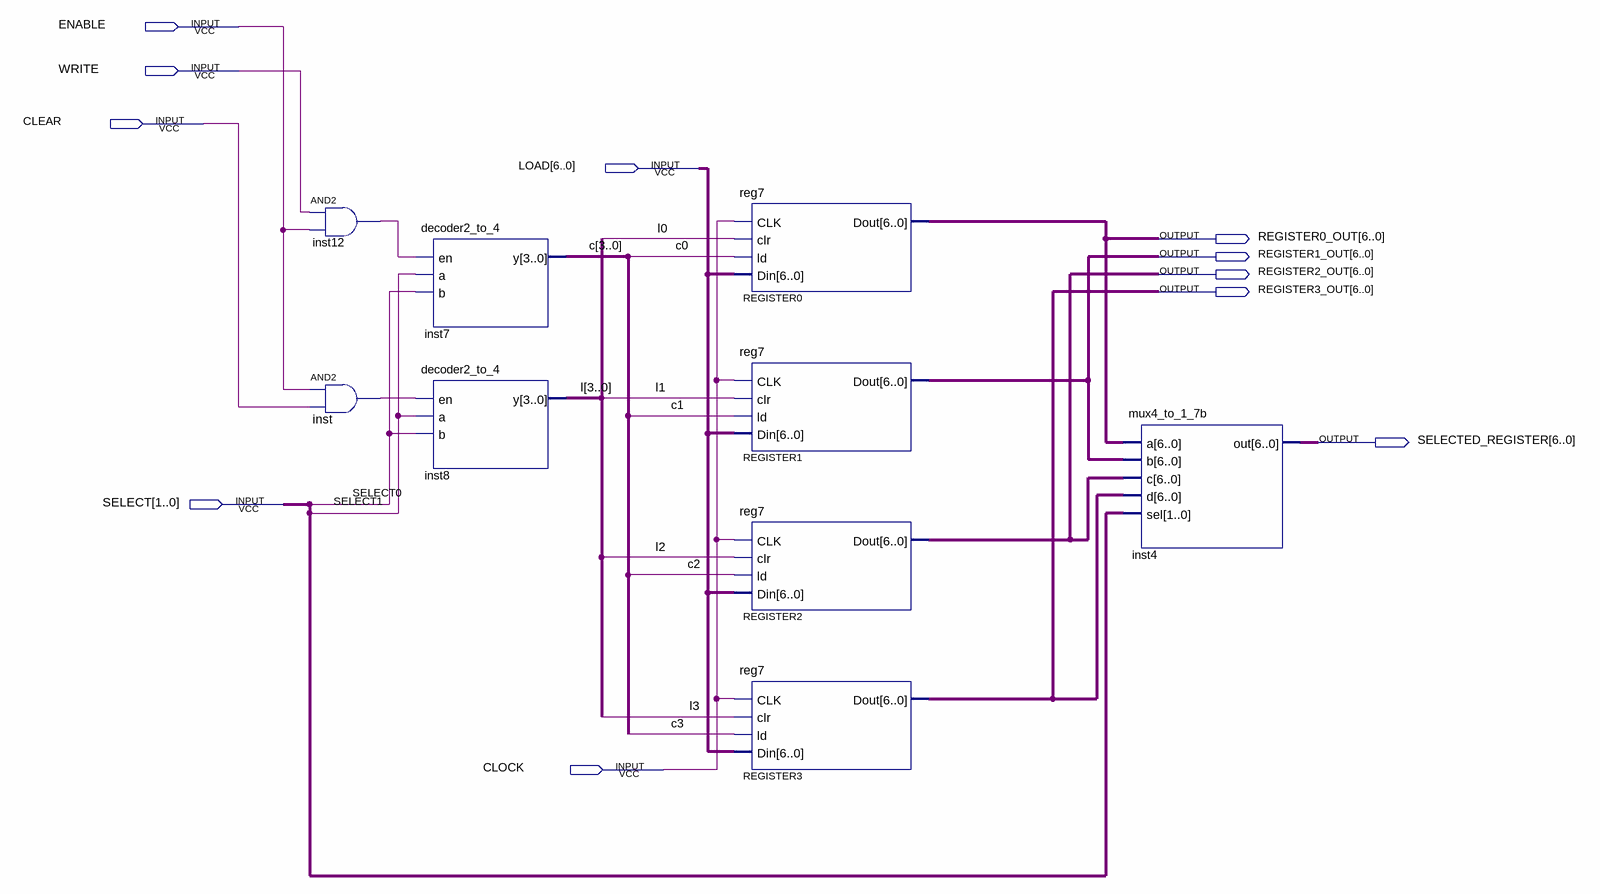
[diagram p0: schematic sheet]
// Quartus schematic memoryUnit.bdf as structural Verilog: 9 symbols, 11 pins
module memoryUnit (
  input  ENABLE,
  input  WRITE,
  input  CLEAR,
  input  [6:0] LOAD,
  input  [1:0] SELECT,
  input  CLOCK,
  output [6:0] REGISTER0_OUT,
  output [6:0] REGISTER1_OUT,
  output [6:0] REGISTER2_OUT,
  output [6:0] REGISTER3_OUT,
  output [6:0] SELECTED_REGISTER
);

  wire inst12_out, inst_out;
  wire [3:0] c, l;

  and inst12 (inst12_out, WRITE, ENABLE);
  and inst (inst_out, ENABLE, CLEAR);
  decoder2_to_4 inst7 (.en(inst12_out), .a(SELECT[1]), .b(SELECT[0]), .y(c));
  decoder2_to_4 inst8 (.en(inst_out), .a(SELECT[1]), .b(SELECT[0]), .y(l));
  reg7 REGISTER0 (.CLK(CLOCK), .clr(l[0]), .ld(c[0]), .Din(LOAD), .Dout(REGISTER0_OUT));
  reg7 REGISTER1 (.CLK(CLOCK), .clr(l[1]), .ld(c[1]), .Din(LOAD), .Dout(REGISTER1_OUT));
  reg7 REGISTER2 (.CLK(CLOCK), .clr(l[2]), .ld(c[2]), .Din(LOAD), .Dout(REGISTER2_OUT));
  reg7 REGISTER3 (.CLK(CLOCK), .clr(l[3]), .ld(c[3]), .Din(LOAD), .Dout(REGISTER3_OUT));
  mux4_to_1_7b inst4 (
    .a(REGISTER0_OUT), .b(REGISTER1_OUT), .c(REGISTER2_OUT), .d(REGISTER3_OUT), .sel(SELECT),
    .out(SELECTED_REGISTER));
endmodule
